# Altium schematic sheet Sheet1.SchDoc
size A3; SheetNumber: 1; SheetTotal: 1
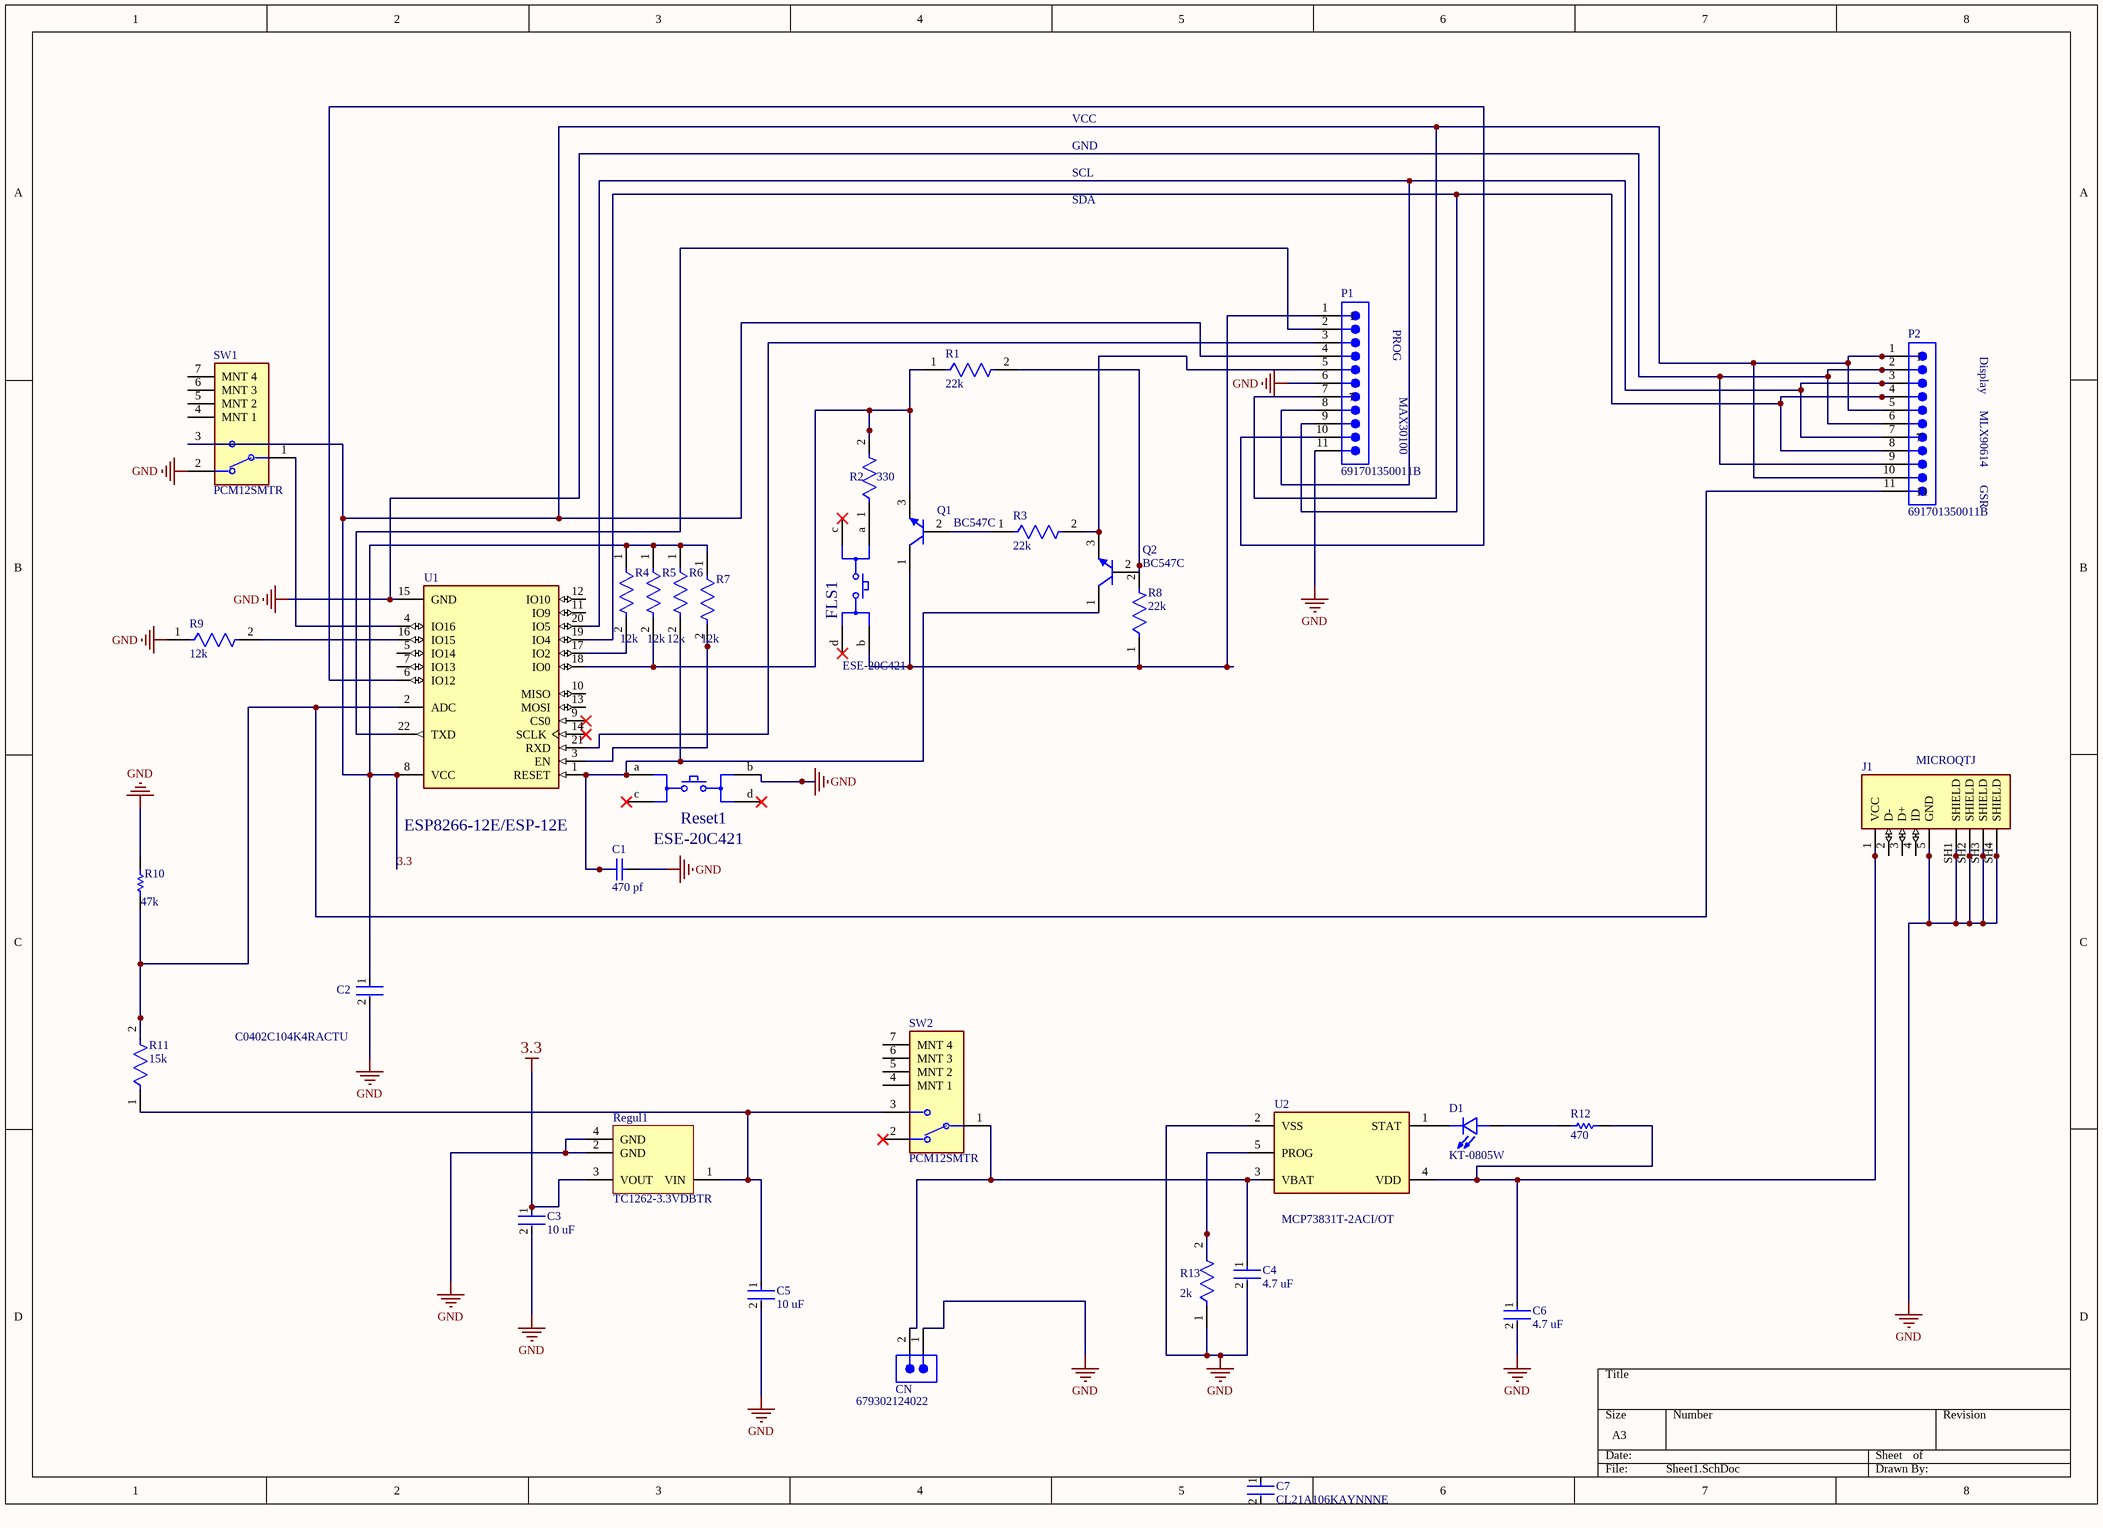
[diagram p0: Sheet1.SchDoc]

## Parts
C1  470 pf  [CAPC2013X135X50LL15T20]
C2  C0402C104K4RACTU  [FP-C0402-BB-MFG]
C3  10 uF  [FP-CL21-IPC_A]
C4  4.7 uF  [FP-CL21-IPC_A]
C5  10 uF  [FP-CL21-IPC_A]
C6  4.7 uF  [FP-CL21-IPC_A]
C7  CL21A106KAYNNNE  [FP-CL21-IPC_A]
CN  679302124022  [679302124022]
D1  KT-0805W  [LED_KT-0805W]
FLS1  ESE-20C421  [FP-ESE-20C421-MFG]
J1  MICROQTJ  [SHOUHAN_MICROQTJ]
P1  691701350011B  [691701350011B]
P2  691701350011B  [691701350011B]
Q1  BC547C  [ONSC-TO-92-3-29-11]
Q2  BC547C  [ONSC-TO-92-3-29-11]
R1  22k  [FP-CRCW0603-e3-IPC_B]
R2  330  [FP-CRCW0402-e3-IPC_C]
R3  22k  [FP-CRCW0603-e3-IPC_B]
R4  12k  [FP-CRCW0603-e3-IPC_A]
R5  12k  [FP-CRCW0603-e3-IPC_A]
R6  12k  [FP-CRCW0603-e3-IPC_A]
R7  12k  [FP-CRCW0603-e3-IPC_A]
R8  22k  [FP-CRCW0603-e3-IPC_B]
R9  12k  [FP-CRCW0603-e3-IPC_A]
R10  47k  [RESC2013X70X40ML20T20]
R11  15k  [FP-CRCW0805-e3-IPC_C]
R12  470  [RESC2013X60X35LL10T20]
R13  2k  [FP-AC0603-IPC_B]
Regul1  TC1262-3.3VDBTR  [SOT-223-DB3_M]
Reset1  ESE-20C421  [FP-ESE-20C421-MFG]
SW1  PCM12SMTR  [FP-PCM12SMTR-MFG]
SW2  PCM12SMTR  [FP-PCM12SMTR-MFG]
U1  ESP8266-12E/ESP-12E  [XCVR_ESP8266-12E/ESP-12E]
U2  MCP73831T-2ACI/OT  [FP-C04-091-OT-IPC_B]

## Nets
3.3: C2.1 C3.1 P1.4 P1.7 P2.1 P2.5 P2.10 R4.1 R5.1 R6.1 R7.1 Regul1.3(VOUT) SW1.3 U1.8(VCC)
GND: C1.2 C2.2 C3.2 C4.2 C5.2 C6.2 CN.1 J1.5(GND) J1.SH1(SHIELD) J1.SH2(SHIELD) J1.SH3(SHIELD) J1.SH4(SHIELD) P1.6 P1.11 P2.2 P2.6 P2.9 R9.1 R10.2 R13.1 Regul1.2(GND) Regul1.4(GND) Reset1.b SW1.2 U1.15(GND) U2.2(VSS)
NetC1_1: C1.1 Q2.1(C) R6.2 Reset1.a U1.1(RESET)
NetC4_1: C4.1 CN.2 SW2.1 U2.3(VBAT)
NetC5_1: C5.1 R11.1 Regul1.1(VIN) SW2.3
NetC6_1: C6.1 J1.1(VCC) R12.2 U2.4(VDD)
NetD1_A: D1.A R12.1
NetD1_C: D1.C U2.1(STAT)
NetFLS1_b: FLS1.b P1.1 Q1.1(C) R8.1
NetP1_2: P1.2 U1.22(TXD)
NetP1_3: P1.3 U1.21(RXD)
NetP1_5: P1.5 Q2.3(E) R3.2
NetP1_8: P1.8 P2.3 P2.7 U1.20(IO5)
NetP1_9: P1.9 P2.4 P2.8 U1.19(IO4)
NetP1_10: P1.10 U1.6(IO12)
NetP2_11: P2.11 R10.1 R11.2 U1.2(ADC)
NetQ1_2: Q1.2(B) R3.1
NetQ1_3: Q1.3(E) R1.1 R2.2 R5.2 U1.18(IO0)
NetQ2_2: Q2.2(B) R1.2 R8.2
NetR4_2: R4.2 U1.17(IO2)
NetR7_2: R7.2 U1.3(EN)
NetR9_2: R9.2 U1.16(IO15)
NetR13_2: R13.2 U2.5(PROG)
NetSW1_1: SW1.1 U1.4(IO16)

Not connected (* = marked no-connect by the designer): C7 1 2; FLS1 a c* d*; J1 2(D-) 3(D+) 4(ID); R2 1; Reset1 c* d*; SW1 4(MNT_1) 5(MNT_2) 6(MNT_3) 7(MNT_4); SW2 2* 4(MNT_1) 5(MNT_2) 6(MNT_3) 7(MNT_4); U1 5(IO14) 7(IO13) 9(CS0)* 10(MISO) 11(IO9) 12(IO10) 13(MOSI) 14(SCLK)*

## Notes on the sheet
- SCL
- GND
- VCC
- SDA
- (near P1) PROG
- Display
- MAX30100
- MLX90614
- GSR

## Library data of the parts
C1 = CMP-2007-03450-1: Manufacturer: Vitramon; Part Number: VJ0805Y472KXACW1BC
C2 = CMP-2008-02108-2: CAP CER 0.1UF 16V X7R 0402; Manufacturer: Kemet; Value: 0.10 μF; Tolerance: 0.1; Material: Ceramic; Temperature Coefficient: 15%; Voltage Rating: 16 V; Package: C0402-BB; Automotive: No; Ipc Land Pattern Name: CAPC10050X50; Device Class L3: Ceramic Capacitors; Capacitance: 0.10 μF; Octopart: https://octopart.com/c0402c104k4ractu-kemet-94158; Temperature Characteristic: X7R; Mouser Description: Cap Ceramic 0.1uF 16V X7R 10% SMD 0402 125?C Paper T/R - Tape and Reel (Alt: C0402C104K4RAC TU); ComponentLink2Description: Datasheet; Temperature Range Low: -55°C; RoHS: TRUE; Device Class L1: Passive Components; Manufacturer Part Number: C0402C104K4RACTU; Temperature Range High: +125°C; Device Class L2: Capacitors; ComponentLink2URL: https://content.kemet.com/datasheets/KEM_C1002_X7R_SMD.pdf; Category: Cap; Height: 0.55mm; Temperature: -55°C to +125°C; Lead Free: Yes; Digikey Description: CAP CER 0.1UF 16V X7R 0402
C3 C5 C7 = CMP-13271-002975-1: CL21 Series 0805 10uF 25V ±10% Tolerance X5R Multilayer Ceramic Chip Capacitor; Case Code (Imperial): 0805; Length: 2mm; Case/Package: 0805; Packaging: Tape and Reel; Width: 0.049inch; Tolerance: 10%; Mount: Surface Mount; Min Operating Temperature: -55°C; Thickness: 0.057inch; Height: 1.25mm; Dielectric: X5R; Package Quantity: 1; Depth: 1.25mm; Capacitance: 10uF; Voltage Rating: 25V; Case Code (Metric): 2012; Max Operating Temperature: 85°C; Radiation Hardening: No
C4 C6 = CMP-13271-002624-1: CL21 Series 0805 4.7uF 25V ±10% Tolerance X5R Multilayer Ceramic Chip Capacitor; Case Code (Imperial): 0805; Thickness: 0.055inch; Mount: Surface Mount; Case Code (Metric): 2012; Capacitance: 4.7uF; Depth: 1.25mm; Lead Free: Lead Free; Case/Package: 0805; Voltage Rating: 25V; Package Quantity: 1; Width: 0.049inch; Radiation Hardening: No; Voltage Rating (DC): 25V; Length: 2mm; Dielectric: X5R; Height: 1.25mm; Packaging: Tape and Reel; Tolerance: 10%; Min Operating Temperature: -55°C; Max Operating Temperature: 85°C
CN = CMP-1502-00721-2: NexarPartId: 18818281; Number of Positions: 2; Connector Type: Male Pin; Contact Resistance: 20mΩ; Operating Supply Voltage: 50V; Insulation: Insulated; Gender: Male; Pitch: 1.5mm; Insulation Resistance: 100MΩ; Current Rating: 1A; Flammability Rating: UL94 V-0; Contact Gender: Male; Orientation: Vertical; Color: Beige, White; Termination: SMD/SMT; Length: 6mm; Width: 6mm; Packaging: Tape and Reel; Contact Material: Copper; Contact Plating: Tin; Mount: Surface Mount; Max Operating Temperature: 85°C; Number of Pins: 2; Voltage Rating: 50V; Housing Material: Nylon; Number of Contacts: 2; Number of Rows: 1; Height: 5mm; Lead Pitch: 1.5mm; REACH SVHC: Unknown; RoHS: Compliant; Min Operating Temperature: -25°C
D1 = KT-0805W: Light Emitting Diodes; MF: Hubei KENTO Elec; SnapEDA_Link: https://www.snapeda.com/parts/KT-0805W/Hubei+KENTO+Elec/view-part/?ref=snap; Package: Package; Value: *; MP: KT-0805W; Check_prices: https://www.snapeda.com/parts/KT-0805W/Hubei+KENTO+Elec/view-part/?ref=eda
FLS1 Reset1 = CMP-05613-000006-1: SWITCH PUSH SPST-NO 0.1A 14V; Current Rating: 100mA; Switch Function: Off-Mom; Throw Configuration: SPST; Actuator Type: Lever; Operating Force: 4N; Actuator Length: 5.5mm; Series: ESE20C; Package Quantity: 1200; Radiation Hardening: No; Max Voltage Rating (DC): 14V; Voltage Rating (DC): 14V; Max Operating Temperature: 80°C; Lead Free: Lead Free; Mount: Through Hole; Termination: PC Pin; Packaging: Bulk; Min Operating Temperature: -30°C; RoHS Compliant: Yes; Contact Current Rating: 100mA; REACH SVHC: No SVHC; Orientation: Straight
J1 = MICROQTJ: MF: shou han; Price: None; Value: *; Check_prices: https://www.snapeda.com/parts/MICROQTJ/Shouhan/view-part/?ref=eda; Package: None; SnapEDA_Link: https://www.snapeda.com/parts/MICROQTJ/Shouhan/view-part/?ref=snap; Availability: Not in stock; MP: MICROQTJ
P1 P2 = CMP-1502-02023-2: NexarPartId: 22866739; Connector Type: Terminal Block; Gender: Male; Number of Contacts: 11; Color: Black; Number of Pins: 11; Termination: PCB; Packaging: Tape and Reel; Lead Pitch: 3.81mm; Housing Material: Polymer; RoHS: Compliant; Contact Material: Brass; Contact Plating: Tin; REACH SVHC: No SVHC
Q1 Q2 = CMP-1048-01437-1: Amplifier Transistor, NPN Silicon, 3-Pin TO-92, Bulk Box; Manufacturer: On Semiconductor; IC Continuous (A): 0.1; fT Min (MHz): 150; Mounting Technology: Through Hole; ComponentLink1URL: http://www.onsemi.com/; ComponentLink1Description: Manufacturer URL; ComponentLink3URL: http://www.onsemi.cn/pub_link/Collateral/2N6426-D.PDF; DatasheetVersion: Rev. 7; PackageVersion: Rev. AM; Packing: Bulk Box; RoHS: FALSE; Polarity: NPN; PartNumber: BC547C; ComponentLink2URL: http://www.onsemi.com/pub_link/Collateral/BC546-D.PDF; ComponentLink3Description: Package Specification; PackageDescription: 3-Pin Transistor Outline, Body 4.825 x 3.685 mm, Pitch 1.27 mm; PackageReference: TO-92-3-29-11_AM_SL; ComponentLink2Description: Datasheet
R1 R3 R8 = CMP-2000-03092-2: RES Thick Film, 22kΩ, 1%, 0.1W, 100ppm/°C, 0603; Voltage Rating: 75V; Max Power Dissipation: 100mW; Resistance: 22kR; Value: 22kR; Radiation Hardening: No; Termination: SMD/SMT; Composition: Thick Film; Tolerance: 1%; Temperature Coefficient: 100ppm/°C; Case Code (Imperial): 0603; Height: 0.45mm; Packaging: Tape and Reel; Power Rating: 100mW; Case/Package: 0603; Number of Terminations: 2; Package Quantity: 10; Weight: 7.1E-05oz; Voltage Rating (DC): 75V; Max Operating Temperature: 155°C; Contact Plating: Tin; Width: 0.85mm; Case Code (Metric): 1608; Mount: Surface Mount; Min Operating Temperature: -55°C; Depth: 0.85mm; Features: Automotive AEC-Q200; Military Standard: Not; Lead Free: Lead Free; Length: 1.55mm
R2 = CMP-2002-08521-2: RES Thick Film, 330kΩ, 1%, 0.063W, 100ppm/°C, 0402; Max Power Dissipation: 63mW; Voltage Rating: 50V; Resistance: 330kR; Composition: Thick Film; Contact Plating: Tin; Packaging: Tape and Reel; Lead Free: Lead Free; Temperature Coefficient: 100ppm/°C; Features: Automotive AEC-Q200; Depth: 0.5mm; Package Quantity: 10; Number of Terminations: 2; Military Standard: Not; Case Code (Imperial): 0402; Tolerance: 1%; Max Operating Temperature: 155°C; Weight: 2.3E-05oz; Length: 1mm; Power Rating: 63mW; Min Operating Temperature: -55°C; Case/Package: 0402; Termination: SMD/SMT; Voltage Rating (DC): 50V; Case Code (Metric): 1005; Width: 0.02inch; Height: 0.35mm
R4-R7 R9 = CMP-2000-03877-2: RES Thick Film, 12kΩ, 1%, 0.1W, 100ppm/°C, 0603; Resistance: 12kR; Voltage Rating: 75V; Power Rating: 100mW; Value: 12kR; Termination: SMD/SMT; Case Code (Metric): 1608; Max Operating Temperature: 155°C; Depth: 0.85mm; Width: 0.033inch; Military Standard: Not; Composition: Thick Film; Features: Automotive AEC-Q200; Lead Free: Lead Free; Weight: 7.1E-05oz; Mount: Surface Mount; Height: 0.45mm; Min Operating Temperature: -55°C; Tolerance: 1%; Case/Package: 0603; Temperature Coefficient: 100ppm/°C; Contact Plating: Tin; Voltage Rating (DC): 75V; Length: 1.55mm; Packaging: Tape and Reel; Case Code (Imperial): 0603; Max Power Dissipation: 100mW; Package Quantity: 10; Radiation Hardening: No; Number of Terminations: 2
R10 = CMP-2001-00421-1: Manufacturer: Panasonic; Part Number: ERJ-6GEYJ473V
R11 = CMP-2001-04967-2: RES Thick Film, 15kΩ, 1%, 0.125W, 100ppm/°C, 0805; Power Rating: 125mW; Voltage Rating: 150V; Resistance: 15kR; Height: 0.45mm; Number of Terminations: 2; Composition: Thick Film; Length: 2mm; Case/Package: 0805; Depth: 1.25mm; Min Operating Temperature: -55°C; Lead Free: Lead Free; Mount: Surface Mount; Package Quantity: 10; Termination: SMD/SMT; Packaging: Tape and Reel; Case Code (Metric): 2012; Features: Automotive AEC-Q200; Military Standard: Not; Width: 0.049inch; Temperature Coefficient: 100ppm/°C; Max Power Dissipation: 125mW; Weight: 0.000194oz; Tolerance: 1%; Voltage Rating (DC): 150V; Max Operating Temperature: 155°C; Radiation Hardening: No; Contact Plating: Tin; Case Code (Imperial): 0805
R12 = CMP-2000-06961-1: Chip Resistor, 470 Ohm, +/- 1%, 125 mW, -55 to 155 degC, 0805 (2012 Metric), RoHS, Tape and Reel; Manufacturer: Yageo; Power Rating: 250mW; Resistor Case Style: 0805[2012Metric]; Voltage Rating: 150V; Resistor Element Type: ThickFilm; Temperature Coefficient: ±100ppm/°C; Resistance: 470ohm; SVHC: ToBeAdvised; Datasheet Version: Rev. 7, 05/2017; Automotive Qualification Standard: -; Mounting Technology: SurfaceMount; Product Range: -; Packaging: Tape&Reel; Package Description: 2-Pin Surface Mounted Device, Body 2 x 1.25 mm; MSL: MSL1-Unlimited; Package Reference: 0805; Resistance Tolerance: ±1%; Datasheet URL: http://www.yageo.com/documents/recent/PYu-RC_Group_51_RoHS_L_7.pdf; Manufacturer URL: http://www.yageo.com/
R13 = CMP-2000-04836-2: RES 2kΩ 1.00% 0.1W 0603; Resistance: 2kR; Voltage Rating: 50V; Max Power Dissipation: 100mW; Temperature Coefficient: 100ppm/°C; Tolerance: 1%; Height: 0.45mm; Case Code (Imperial): 0603; Number of Terminations: 2; Termination: SMD/SMT; Max Operating Temperature: 155°C; Min Operating Temperature: -55°C; Features: Moisture Resistant; Size Code: 0603; Military Standard: Not; Depth: 0.8mm; Lead Free: Lead Free; Ratings: AEC-Q200; Case Code (Metric): 1608; Power Rating: 100mW; Resistor Type: Thick Film; Length: 1.6mm; Case/Package: 0603; Packaging: Tape and Reel; Width: 0.8mm; Construction: Rectangular; Series: AC
Regul1 = CMP-0136-00481-1: 500mA Fixed Output CMOS LDO, 3-Pin SOT-223, Extended Temperature, Tape and Reel; PackageVersion: revBB, Aug-2009; PackageDescription: 3-Lead Plastic Small Outline Transistor (DB) [SOT-223]; DatasheetVersion: revB, 2002; PackageReference: SOT-223-DB3
SW1 SW2 = CMP-2000-06884-2: SWITCH SLIDE SPDT 300MA 6V; Actuator Material: Nylon; Switch Function: On-On; Insulation Resistance: 100mR; Actuator Type: Standard; Mechanical Life: 10000Cycles; Actuator Length: 1.5mm; Contact Resistance: 70mR; Min Operating Temperature: -20°C; Max Current Rating: 300mA; Max Voltage Rating (DC): 6V; Package Quantity: 1; Mount: Surface Mount; Packaging: Tape and Reel; Contact Plating: Silver; Depth: 5mm; REACH SVHC: No SVHC; Voltage Rating (DC): 6V; Voltage Rating (AC): 6V; Max Operating Temperature: 85°C; Length: 7.7mm; Termination: Gull Wing; Current Rating: 300mA; Contact Current Rating: 300mA; Orientation: Right Angle; Width: 6.7mm; Switch Travel: 1.5mm; Lead Free: Lead Free; Contact Material: Copper Alloy; Throw Configuration: SPDT
U1 = ESP8266-12E/ESP-12E: This WiFi module has a 32-bit MCU micro and clock speeds supporting 80 MHz or 160 MHz. Supports the RTOS and integrated Wi-Fi MAC/BB/RF/PA/LNA, and has an on-board antenna.; MF: AI-Thinker; Value: *; SnapEDA_Link: https://www.snapeda.com/parts/ESP8266-12E/ESP-12E/AI-Thinker/view-part/?ref=snap; Availability: Not in stock; Price: None; Package: None; Check_prices: https://www.snapeda.com/parts/ESP8266-12E/ESP-12E/AI-Thinker/view-part/?ref=eda; MP: ESP8266-12E/ESP-12E
U2 = CMP-0133-00143-2: IC CONTROLLR LI-ION 4.2V SOT23-5; Max Power Dissipation: 1.54W; Output Current: 500mA; Max Output Voltage: 4.5V; Number of Outputs: 1; Min Output Voltage: 4.168V; Min Supply Voltage: 3.75V; Max Input Voltage: 6V; Voltage Rating: 4.534V; Drain to Source Resistance: 350mR; Max Operating Temperature: 85°C; Length: 0.122inch; Number of Pins: 5; REACH SVHC: No SVHC; Radiation Hardening: No; Min Operating Temperature: -40°C; Weight: 0.00709oz; Contact Plating: Tin; Termination: SMD/SMT; Case/Package: SOT-23; Mount: Surface Mount; Width: 0.071inch; Packaging: Tape and Reel; Number of Cells: 1; Max Charge Current: 500mA; Height: 0.051inch; Number of Channels: 1; Output Voltage: 4.2V; Max Supply Voltage: 6V; Lead Free: Lead Free